# Altium schematic sheet FPGA.SCHDOC: FPGA Connections
size A2; Address1: Level 3, 12a Rodborough Rd; Address2: Frenchs Forest 2086; Address3: NSW; Address4: AUSTRALIA; SheetNumber: 4; SheetTotal: 23; PageSetup: Record=PageOptions|CenterHorizontal=True|CenterVertical=True|PrintScale=0.71|XCorrection=1.00|YCorrection=1.00|PrintKind=0|BorderSize=5000000|LeftOffset=0|BottomOffset=0|Orientation=2|PaperLength=4199|PaperWidth=2969|Scale=100|PaperSource=7|PrintQuality=600|MediaType=1|DitherType=10|PaperKind=A3 (297 x 420 mm)|PrintScaleMode=1
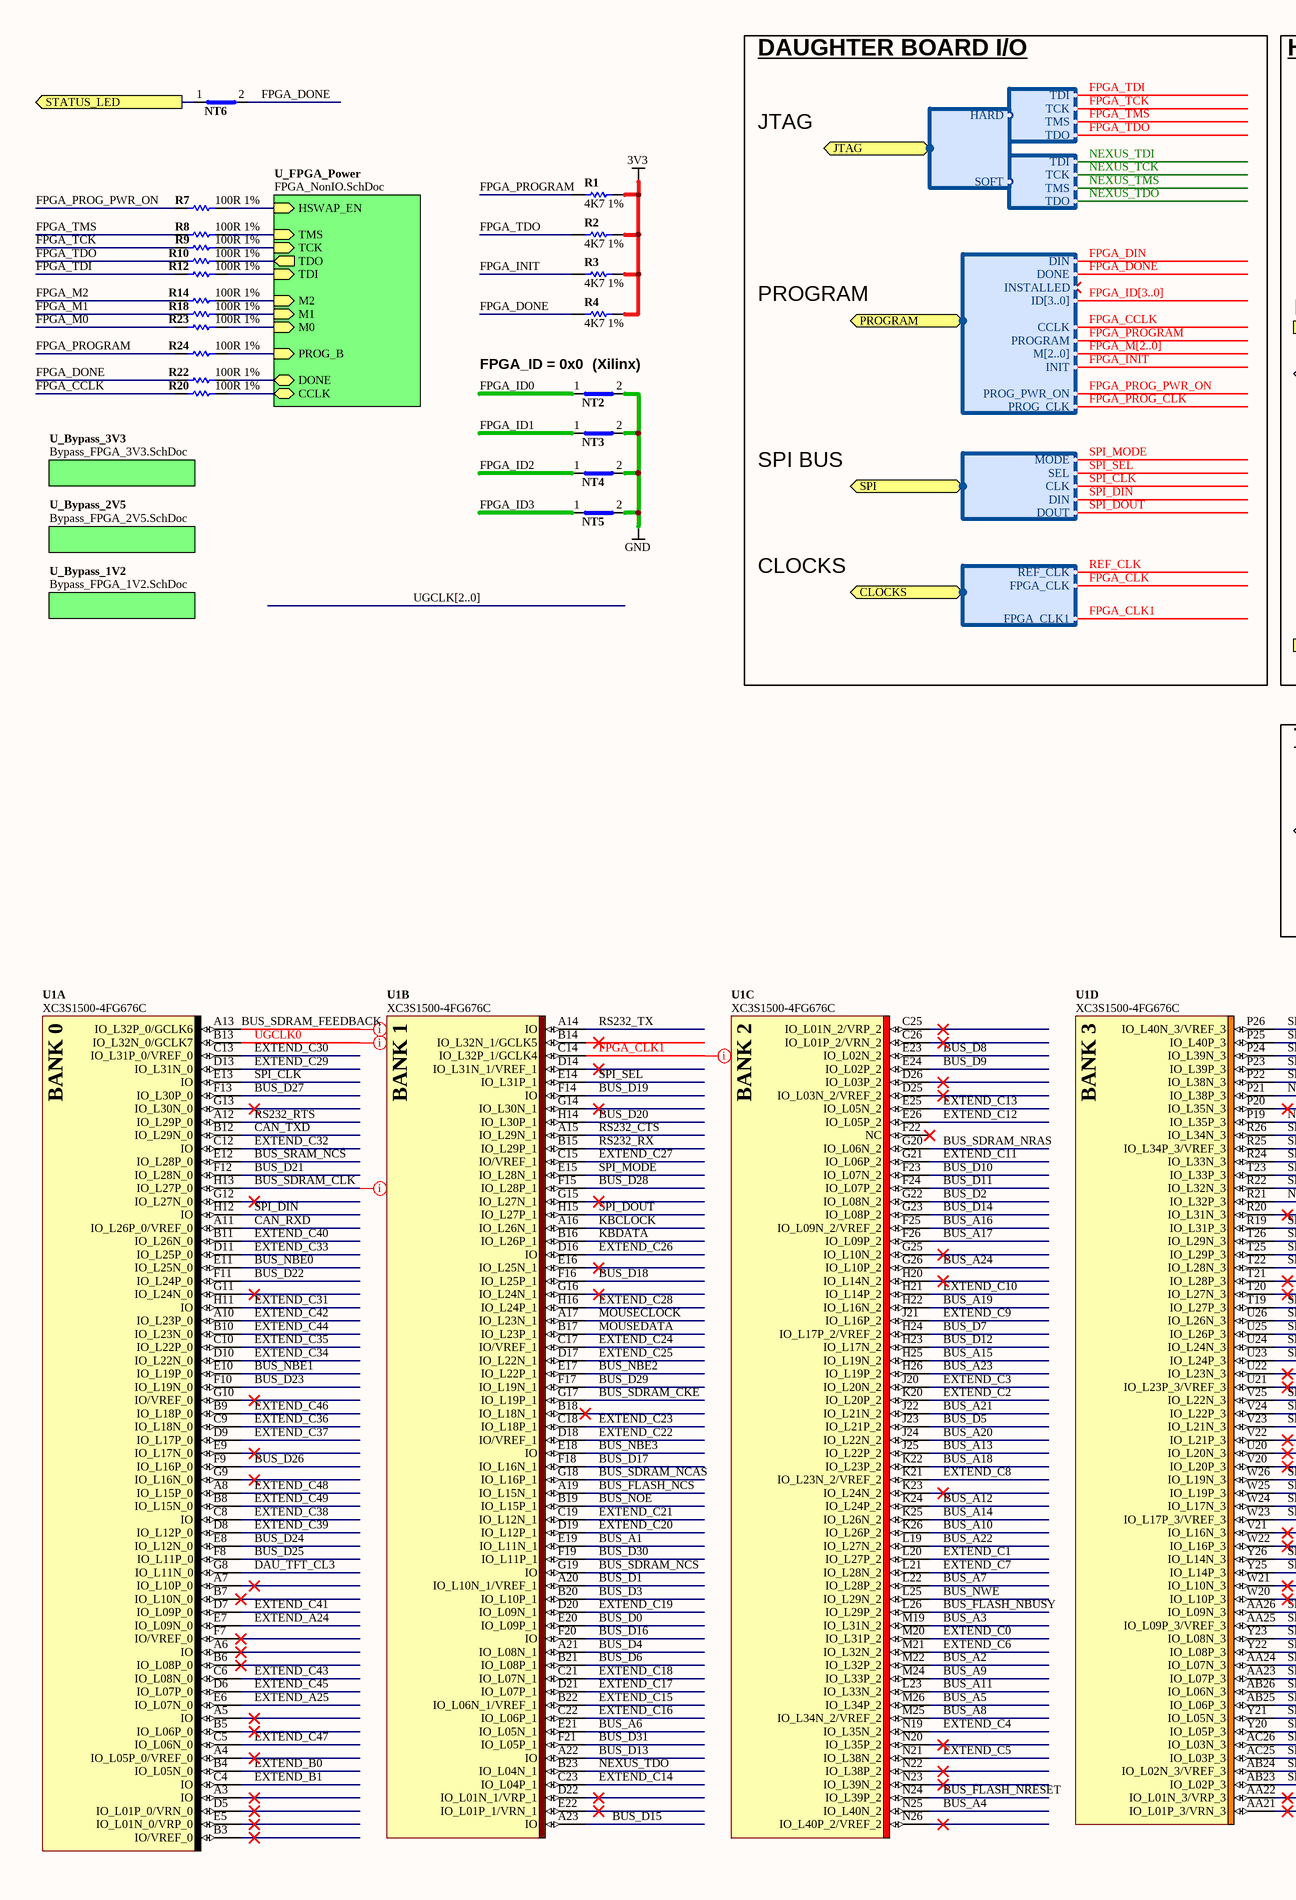
[diagram p0: FPGA.SCHDOC, left]
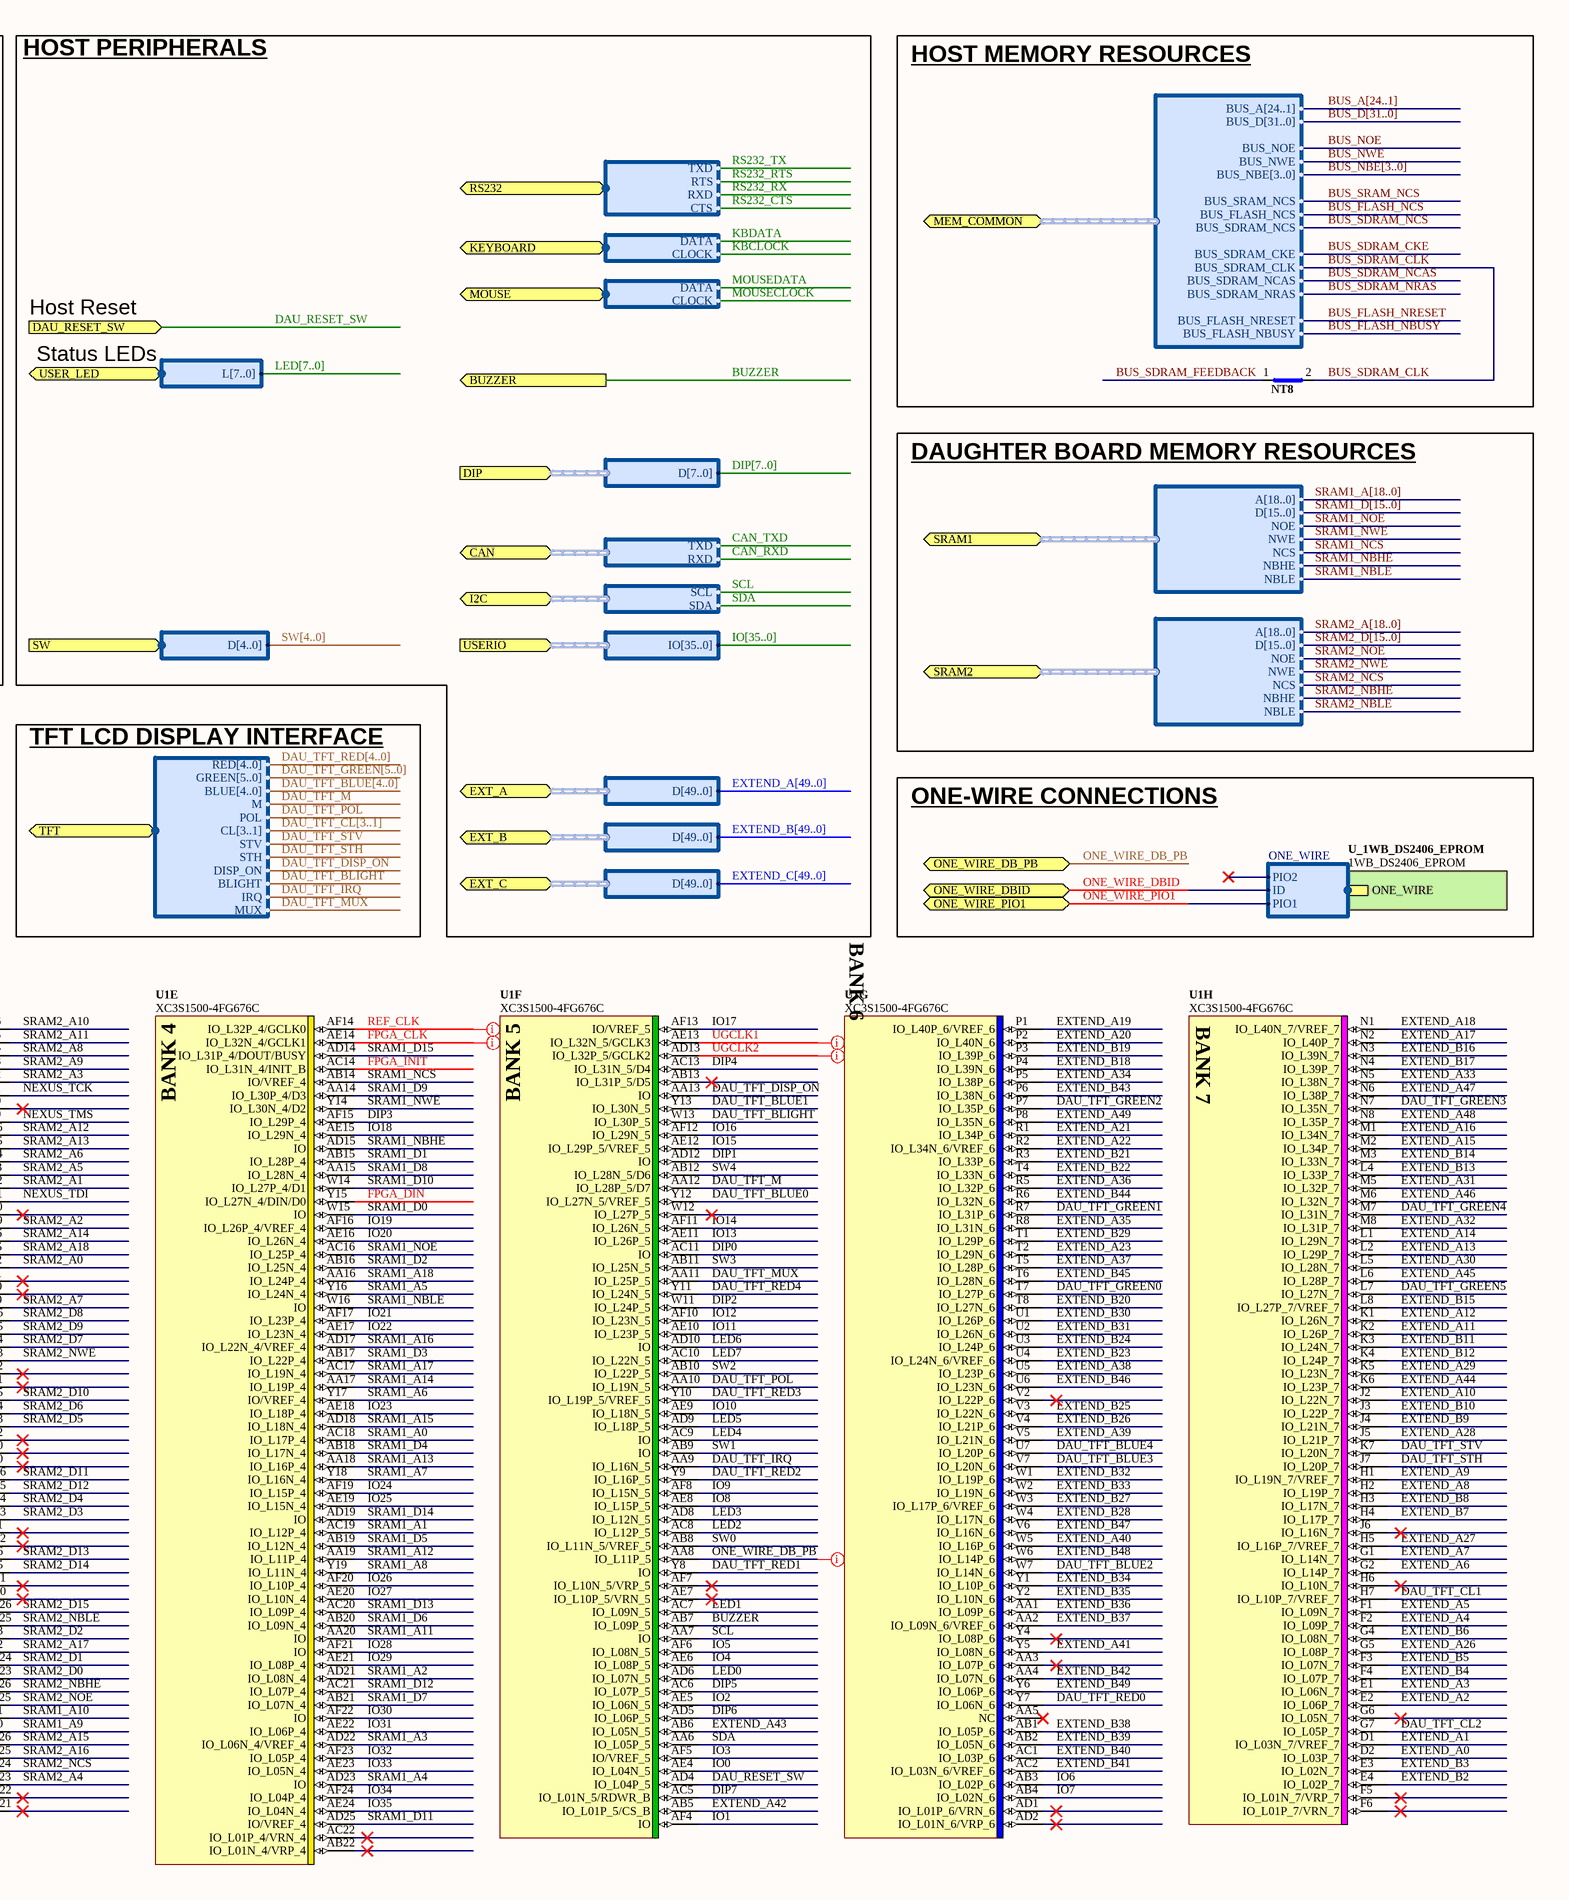
[diagram p1: FPGA.SCHDOC, right]

## Parts
NT2  Net Tie SMT2  [NETTIE-SMT2-8X8]  (value not drawn)  (net tie, no BOM)
NT3  Net Tie SMT2  [NETTIE-SMT2-8X8]  (value not drawn)  (net tie, no BOM)
NT4  Net Tie SMT2  [NETTIE-SMT2-8X8]  (value not drawn)  (net tie, no BOM)
NT5  Net Tie SMT2  [NETTIE-SMT2-8X8]  (value not drawn)  (net tie, no BOM)
NT6  Net Tie SMT2  [NETTIE-SMT2-8X8]  (value not drawn)  (net tie, no BOM)
NT8  Net Tie SMT2  [NETTIE-SMT2-8X8]  (value not drawn)  (net tie, no BOM)
R1  4K7 1%  [RESC1005-STAR]
R2  4K7 1%  [RESC1005-STAR]
R3  4K7 1%  [RESC1005-STAR]
R4  4K7 1%  [RESC1005-STAR]
R7  100R 1%  [RESC1005-STAR]
R8  100R 1%  [RESC1005-STAR]
R9  100R 1%  [RESC1005-STAR]
R10  100R 1%  [RESC1005-STAR]
R12  100R 1%  [RESC1005-STAR]
R14  100R 1%  [RESC1005-STAR]
R18  100R 1%  [RESC1005-STAR]
R20  100R 1%  [RESC1005-STAR]
R22  100R 1%  [RESC1005-STAR]
R23  100R 1%  [RESC1005-STAR]
R24  100R 1%  [RESC1005-STAR]
U1  XC3S1500-4FG676C  [BGA100P26X26-676]  (parts A,B,C,D,E,F,G,H of 12)

## Blocks framed on the sheet
HOST MEMORY RESOURCES: NT8

## Sub-sheets
U_1WB_DS2406_EPROM = 1WB_DS2406_EPROM: ONE_WIRE (harness ONE_WIRE)
U_Bypass_1V2 = Bypass_FPGA_1V2.SchDoc: no entries
U_Bypass_2V5 = Bypass_FPGA_2V5.SchDoc: no entries
U_Bypass_3V3 = Bypass_FPGA_3V3.SchDoc: no entries
U_FPGA_Power = FPGA_NonIO.SchDoc: TMS (in), DONE (bidir), M1 (in), CCLK (bidir), M0 (in), M2 (in), TCK (in), HSWAP_EN (in), TDI (in), PROG_B (in), TDO (out)

## Ports
BUZZER (out), CAN (harness CAN_INT), CLOCKS (harness DAU_CLK), DAU_RESET_SW (in), DIP (harness SW8), EXT_A (harness PBIO), EXT_B (harness PBIO), EXT_C (harness PBIO), I2C (harness I2C), JTAG (harness HARDSOFT_JTAG), KEYBOARD (harness PS2), MEM_COMMON (harness HOSTMEMORY), MOUSE (harness PS2), ONE_WIRE_DB_PB (bidir), ONE_WIRE_DBID (bidir), ONE_WIRE_PIO1 (bidir), PROGRAM (harness DAU_CTRL), RS232 (harness RS232_INT), SPI (harness DAU_SPI), SRAM1 (harness SRAM-256Kx16), SRAM2 (harness SRAM-256Kx16), STATUS_LED (out), SW (harness SW5), TFT (harness DAU_TFT), USER_LED (harness LED8), USERIO (harness IO36)

## Harnesses
ONE_WIRE: ID, PIO1, PIO2
SRAM-256Kx16: A[18..0], D[15..0], NCS, NWE, NOE, NBHE, NBLE
HOSTMEMORY: BUS_A[24..1], BUS_D[31..0], BUS_NOE, BUS_NWE, BUS_NBE[3..0], BUS_SRAM_NCS, BUS_FLASH_NCS, BUS_SDRAM_NCS, BUS_SDRAM_CKE, BUS_SDRAM_CLK, BUS_SDRAM_NCAS, BUS_SDRAM_NRAS, BUS_FLASH_NRESET, BUS_FLASH_NBUSY
DAU_CLK: REF_CLK, FPGA_CLK, FPGA_CLK1
DAU_SPI: MODE, SEL, CLK, DIN, DOUT
DAU_CTRL: DIN, DONE, INSTALLED, ID[3..0], CCLK, PROGRAM, M[2..0], INIT, PROG_PWR_ON, PROG_CLK
JTAG: TMS, TDO, TDI, TCK
HARDSOFT_JTAG: HARD, SOFT
LED8: L[7..0]
SW5: D[4..0]
DAU_TFT: RED[4..0], GREEN[5..0], BLUE[4..0], M, POL, CL[3..1], STV, STH, DISP_ON, BLIGHT, IRQ, MUX
PS2: DATA, CLOCK
RS232_INT: RXD, TXD, RTS, CTS
IO36: IO[35..0]
SW8: D[7..0]
CAN_INT: TXD, RXD
I2C: SCL, SDA
PBIO: D[49..0]

## Nets
3V3: R1.2 R2.2 R3.2 R4.2
GND: NT2.2(Net2) NT3.2(Net2) NT4.2(Net2) NT5.2(Net2)
BUS_A1: U1.E19(IO_L11N_1)
BUS_A2: U1.M22(IO_L32P_2)
BUS_A3: U1.M19(IO_L31N_2)
BUS_A4: U1.N25(IO_L40N_2)
BUS_A5: U1.M26(IO_L34P_2)
BUS_A6: U1.E21(IO_L05N_1)
BUS_A7: U1.L22(IO_L28P_2)
BUS_A8: U1.M25(IO_L34N_2/VREF_2)
BUS_A9: U1.M24(IO_L33P_2)
BUS_A10: U1.K26(IO_L26P_2)
BUS_A11: U1.L23(IO_L33N_2)
BUS_A12: U1.K24(IO_L24P_2)
BUS_A13: U1.J25(IO_L22P_2)
BUS_A14: U1.K25(IO_L26N_2)
BUS_A15: U1.H25(IO_L19N_2)
BUS_A16: U1.F25(IO_L09N_2/VREF_2)
BUS_A17: U1.F26(IO_L09P_2)
BUS_A18: U1.K22(IO_L23P_2)
BUS_A19: U1.H22(IO_L16N_2)
BUS_A20: U1.J24(IO_L22N_2)
BUS_A21: U1.J22(IO_L21N_2)
BUS_A22: U1.L19(IO_L27N_2)
BUS_A23: U1.H26(IO_L19P_2)
BUS_A24: U1.G26(IO_L10P_2)
BUS_D0: U1.E20(IO_L09P_1)
BUS_D1: U1.A20(IO_L10N_1/VREF_1)
BUS_D2: U1.G22(IO_L08N_2)
BUS_D3: U1.B20(IO_L10P_1)
BUS_D4: U1.A21(IO_L08N_1)
BUS_D5: U1.J23(IO_L21P_2)
BUS_D6: U1.B21(IO_L08P_1)
BUS_D7: U1.H24(IO_L17P_2/VREF_2)
BUS_D8: U1.E23(IO_L02N_2)
BUS_D9: U1.E24(IO_L02P_2)
BUS_D10: U1.F23(IO_L07N_2)
BUS_D11: U1.F24(IO_L07P_2)
BUS_D12: U1.H23(IO_L17N_2)
BUS_D13: U1.A22(IO)
BUS_D14: U1.G23(IO_L08P_2)
BUS_D15: U1.A23(IO)
BUS_D16: U1.F20(IO)
BUS_D17: U1.F18(IO_L16N_1)
BUS_D18: U1.F16(IO_L25P_1)
BUS_D19: U1.F14(IO)
BUS_D20: U1.H14(IO_L30P_1)
BUS_D21: U1.F12(IO_L28N_0)
BUS_D22: U1.F11(IO_L24P_0)
BUS_D23: U1.F10(IO_L19N_0)
BUS_D24: U1.E8(IO_L12N_0)
BUS_D25: U1.F8(IO_L11P_0)
BUS_D26: U1.F9(IO_L16P_0)
BUS_D27: U1.F13(IO_L30P_0)
BUS_D28: U1.F15(IO_L28P_1)
BUS_D29: U1.F17(IO_L19N_1)
BUS_D30: U1.F19(IO_L11P_1)
BUS_D31: U1.F21(IO_L05P_1)
BUS_FLASH_NBUSY: U1.L26(IO_L29P_2) ; port MEM_COMMON.BUS_FLASH_NBUSY
BUS_FLASH_NCS: U1.A19(IO_L15N_1) ; port MEM_COMMON.BUS_FLASH_NCS
BUS_FLASH_NRESET: U1.N24(IO_L39P_2) ; port MEM_COMMON.BUS_FLASH_NRESET
BUS_NBE0: U1.E11(IO_L25N_0)
BUS_NBE1: U1.E10(IO_L19P_0)
BUS_NBE2: U1.E17(IO_L22P_1)
BUS_NBE3: U1.E18(IO)
BUS_NOE: U1.B19(IO_L15P_1) ; port MEM_COMMON.BUS_NOE
BUS_NWE: U1.L25(IO_L29N_2) ; port MEM_COMMON.BUS_NWE
BUS_SDRAM_CKE: U1.G17(IO_L19P_1) ; port MEM_COMMON.BUS_SDRAM_CKE
BUS_SDRAM_CLK: NT8.2(Net2) U1.H13(IO_L27P_0) ; port MEM_COMMON.BUS_SDRAM_CLK
BUS_SDRAM_FEEDBACK: NT8.1(Net1) U1.A13(IO_L32P_0/GCLK6)
BUS_SDRAM_NCAS: U1.G18(IO_L16P_1) ; port MEM_COMMON.BUS_SDRAM_NCAS
BUS_SDRAM_NCS: U1.G19(IO) ; port MEM_COMMON.BUS_SDRAM_NCS
BUS_SDRAM_NRAS: U1.G20(IO_L06N_2) ; port MEM_COMMON.BUS_SDRAM_NRAS
BUS_SRAM_NCS: U1.E12(IO_L28P_0) ; port MEM_COMMON.BUS_SRAM_NCS
BUZZER: U1.AB7(IO_L09P_5) ; port BUZZER
CAN_RXD: U1.A11(IO_L26P_0/VREF_0) ; port CAN.RXD
CAN_TXD: U1.B12(IO_L29N_0) ; port CAN.TXD
DAU_RESET_SW: U1.AD4(IO_L04P_5) ; port DAU_RESET_SW
DAU_TFT_BLIGHT: U1.W13(IO_L30P_5) ; port TFT.BLIGHT
DAU_TFT_BLUE0: U1.Y12(IO_L27N_5/VREF_5)
DAU_TFT_BLUE1: U1.Y13(IO_L30N_5)
DAU_TFT_BLUE2: U1.W7(IO_L14N_6)
DAU_TFT_BLUE3: U1.V7(IO_L20N_6)
DAU_TFT_BLUE4: U1.U7(IO_L20P_6)
DAU_TFT_CL1: U1.H7(IO_L10P_7/VREF_7)
DAU_TFT_CL2: U1.G7(IO_L05P_7)
DAU_TFT_CL3: U1.G8(IO_L11N_0)
DAU_TFT_DISP_ON: U1.AA13(IO) ; port TFT.DISP_ON
DAU_TFT_GREEN0: U1.T7(IO_L27P_6)
DAU_TFT_GREEN1: U1.R7(IO_L31P_6)
DAU_TFT_GREEN2: U1.P7(IO_L35P_6)
DAU_TFT_GREEN3: U1.N7(IO_L35N_7)
DAU_TFT_GREEN4: U1.M7(IO_L31N_7)
DAU_TFT_GREEN5: U1.L7(IO_L27N_7)
DAU_TFT_IRQ: U1.AA9(IO_L16N_5) ; port TFT.IRQ
DAU_TFT_M: U1.AA12(IO_L28P_5/D7) ; port TFT.M
DAU_TFT_MUX: U1.AA11(IO_L25P_5) ; port TFT.MUX
DAU_TFT_POL: U1.AA10(IO_L19N_5) ; port TFT.POL
DAU_TFT_RED0: U1.Y7(IO_L06N_6)
DAU_TFT_RED1: U1.Y8(IO)
DAU_TFT_RED2: U1.Y9(IO_L16P_5)
DAU_TFT_RED3: U1.Y10(IO_L19P_5/VREF_5)
DAU_TFT_RED4: U1.Y11(IO_L24N_5)
DAU_TFT_STH: U1.J7(IO_L20P_7) ; port TFT.STH
DAU_TFT_STV: U1.K7(IO_L20N_7) ; port TFT.STV
DIP0: U1.AC11(IO)
DIP1: U1.AD12(IO)
DIP2: U1.W11(IO_L24P_5)
DIP3: U1.AF15(IO_L29P_4)
DIP4: U1.AC13(IO_L31N_5/D4)
DIP5: U1.AC6(IO_L07P_5)
DIP6: U1.AD5(IO_L06P_5)
DIP7: U1.AC5(IO_L01N_5/RDWR_B)
EXTEND_A0: U1.D2(IO_L03P_7)
EXTEND_A1: U1.D1(IO_L03N_7/VREF_7)
EXTEND_A2: U1.E2(IO_L06P_7)
EXTEND_A3: U1.E1(IO_L06N_7)
EXTEND_A4: U1.F2(IO_L09P_7)
EXTEND_A5: U1.F1(IO_L09N_7)
EXTEND_A6: U1.G2(IO_L14P_7)
EXTEND_A7: U1.G1(IO_L14N_7)
EXTEND_A8: U1.H2(IO_L19P_7)
EXTEND_A9: U1.H1(IO_L19N_7/VREF_7)
EXTEND_A10: U1.J2(IO_L22N_7)
EXTEND_A11: U1.K2(IO_L26P_7)
EXTEND_A12: U1.K1(IO_L26N_7)
EXTEND_A13: U1.L2(IO_L29P_7)
EXTEND_A14: U1.L1(IO_L29N_7)
EXTEND_A15: U1.M2(IO_L34P_7)
EXTEND_A16: U1.M1(IO_L34N_7)
EXTEND_A17: U1.N2(IO_L40P_7)
EXTEND_A18: U1.N1(IO_L40N_7/VREF_7)
EXTEND_A19: U1.P1(IO_L40P_6/VREF_6)
EXTEND_A20: U1.P2(IO_L40N_6)
EXTEND_A21: U1.R1(IO_L34P_6)
EXTEND_A22: U1.R2(IO_L34N_6/VREF_6)
EXTEND_A23: U1.T2(IO_L29N_6)
EXTEND_A24: U1.E7(IO_L09N_0)
EXTEND_A25: U1.E6(IO_L07N_0)
EXTEND_A26: U1.G5(IO_L08P_7)
EXTEND_A27: U1.H5(IO_L16P_7/VREF_7)
EXTEND_A28: U1.J5(IO_L21P_7)
EXTEND_A29: U1.K5(IO_L23N_7)
EXTEND_A30: U1.L5(IO_L28N_7)
EXTEND_A31: U1.M5(IO_L32P_7)
EXTEND_A32: U1.M8(IO_L31P_7)
EXTEND_A33: U1.N5(IO_L38N_7)
EXTEND_A34: U1.P5(IO_L38P_6)
EXTEND_A35: U1.R8(IO_L31N_6)
EXTEND_A36: U1.R5(IO_L32P_6)
EXTEND_A37: U1.T5(IO_L28P_6)
EXTEND_A38: U1.U5(IO_L23P_6)
EXTEND_A39: U1.V5(IO_L21N_6)
EXTEND_A40: U1.W5(IO_L16P_6)
EXTEND_A41: U1.Y5(IO_L08N_6)
EXTEND_A42: U1.AB5(IO_L01P_5/CS_B)
EXTEND_A43: U1.AB6(IO_L05N_5)
EXTEND_A44: U1.K6(IO_L23P_7)
EXTEND_A45: U1.L6(IO_L28P_7)
EXTEND_A46: U1.M6(IO_L32N_7)
EXTEND_A47: U1.N6(IO_L38P_7)
EXTEND_A48: U1.N8(IO_L35P_7)
EXTEND_A49: U1.P8(IO_L35N_6)
EXTEND_B0: U1.B4(IO_L05N_0)
EXTEND_B1: U1.C4(IO)
EXTEND_B2: U1.E4(IO_L02P_7)
EXTEND_B3: U1.E3(IO_L02N_7)
EXTEND_B4: U1.F4(IO_L07P_7)
EXTEND_B5: U1.F3(IO_L07N_7)
EXTEND_B6: U1.G4(IO_L08N_7)
EXTEND_B7: U1.H4(IO_L17P_7)
EXTEND_B8: U1.H3(IO_L17N_7)
EXTEND_B9: U1.J4(IO_L21N_7)
EXTEND_B10: U1.J3(IO_L22P_7)
EXTEND_B11: U1.K3(IO_L24N_7)
EXTEND_B12: U1.K4(IO_L24P_7)
EXTEND_B13: U1.L4(IO_L33P_7)
EXTEND_B14: U1.M3(IO_L33N_7)
EXTEND_B15: U1.L8(IO_L27P_7/VREF_7)
EXTEND_B16: U1.N3(IO_L39N_7)
EXTEND_B17: U1.N4(IO_L39P_7)
EXTEND_B18: U1.P4(IO_L39N_6)
EXTEND_B19: U1.P3(IO_L39P_6)
EXTEND_B20: U1.T8(IO_L27N_6)
EXTEND_B21: U1.R3(IO_L33P_6)
EXTEND_B22: U1.T4(IO_L33N_6)
EXTEND_B23: U1.U4(IO_L24N_6/VREF_6)
EXTEND_B24: U1.U3(IO_L24P_6)
EXTEND_B25: U1.V3(IO_L22N_6)
EXTEND_B26: U1.V4(IO_L21P_6)
EXTEND_B27: U1.W3(IO_L17P_6/VREF_6)
EXTEND_B28: U1.W4(IO_L17N_6)
EXTEND_B29: U1.T1(IO_L29P_6)
EXTEND_B30: U1.U1(IO_L26P_6)
EXTEND_B31: U1.U2(IO_L26N_6)
EXTEND_B32: U1.W1(IO_L19P_6)
EXTEND_B33: U1.W2(IO_L19N_6)
EXTEND_B34: U1.Y1(IO_L10P_6)
EXTEND_B35: U1.Y2(IO_L10N_6)
EXTEND_B36: U1.AA1(IO_L09P_6)
EXTEND_B37: U1.AA2(IO_L09N_6/VREF_6)
EXTEND_B38: U1.AB1(IO_L05P_6)
EXTEND_B39: U1.AB2(IO_L05N_6)
EXTEND_B40: U1.AC1(IO_L03P_6)
EXTEND_B41: U1.AC2(IO_L03N_6/VREF_6)
EXTEND_B42: U1.AA4(IO_L07N_6)
EXTEND_B43: U1.P6(IO_L38N_6)
EXTEND_B44: U1.R6(IO_L32N_6)
EXTEND_B45: U1.T6(IO_L28N_6)
EXTEND_B46: U1.U6(IO_L23N_6)
EXTEND_B47: U1.V6(IO_L16N_6)
EXTEND_B48: U1.W6(IO_L14P_6)
EXTEND_B49: U1.Y6(IO_L06P_6)
EXTEND_C0: U1.M20(IO_L31P_2)
EXTEND_C1: U1.L20(IO_L27P_2)
EXTEND_C2: U1.K20(IO_L20P_2)
EXTEND_C3: U1.J20(IO_L20N_2)
EXTEND_C4: U1.N19(IO_L35N_2)
EXTEND_C5: U1.N21(IO_L38N_2)
EXTEND_C6: U1.M21(IO_L32N_2)
EXTEND_C7: U1.L21(IO_L28N_2)
EXTEND_C8: U1.K21(IO_L23N_2/VREF_2)
EXTEND_C9: U1.J21(IO_L16P_2)
EXTEND_C10: U1.H21(IO_L14P_2)
EXTEND_C11: U1.G21(IO_L06P_2)
EXTEND_C12: U1.E26(IO_L05P_2)
EXTEND_C13: U1.E25(IO_L05N_2)
EXTEND_C14: U1.C23(IO_L04P_1)
EXTEND_C15: U1.B22(IO_L06N_1/VREF_1)
EXTEND_C16: U1.C22(IO_L06P_1)
EXTEND_C17: U1.D21(IO_L07P_1)
EXTEND_C18: U1.C21(IO_L07N_1)
EXTEND_C19: U1.D20(IO_L09N_1)
EXTEND_C20: U1.D19(IO_L12P_1)
EXTEND_C21: U1.C19(IO_L12N_1)
EXTEND_C22: U1.D18(IO/VREF_1)
EXTEND_C23: U1.C18(IO_L18P_1)
EXTEND_C24: U1.C17(IO/VREF_1)
EXTEND_C25: U1.D17(IO_L22N_1)
EXTEND_C26: U1.D16(IO)
EXTEND_C27: U1.C15(IO/VREF_1)
EXTEND_C28: U1.H16(IO_L24P_1)
EXTEND_C29: U1.D13(IO_L31N_0)
EXTEND_C30: U1.C13(IO_L31P_0/VREF_0)
EXTEND_C31: U1.H11(IO)
EXTEND_C32: U1.C12(IO)
EXTEND_C33: U1.D11(IO_L25P_0)
EXTEND_C34: U1.D10(IO_L22N_0)
EXTEND_C35: U1.C10(IO_L22P_0)
EXTEND_C36: U1.C9(IO_L18N_0)
EXTEND_C37: U1.D9(IO_L17P_0)
EXTEND_C38: U1.C8(IO)
EXTEND_C39: U1.D8(IO_L12P_0)
EXTEND_C40: U1.B11(IO_L26N_0)
EXTEND_C41: U1.D7(IO_L09P_0)
EXTEND_C42: U1.A10(IO_L23P_0)
EXTEND_C43: U1.C6(IO_L08N_0)
EXTEND_C44: U1.B10(IO_L23N_0)
EXTEND_C45: U1.D6(IO_L07P_0)
EXTEND_C46: U1.B9(IO_L18P_0)
EXTEND_C47: U1.C5(IO_L06N_0)
EXTEND_C48: U1.A8(IO_L15P_0)
EXTEND_C49: U1.B8(IO_L15N_0)
FPGA_CCLK: R20.1 ; port PROGRAM.CCLK
FPGA_CLK: U1.AE14(IO_L32N_4/GCLK1) ; port CLOCKS.FPGA_CLK
FPGA_CLK1: U1.C14(IO_L32P_1/GCLK4) ; port CLOCKS.FPGA_CLK1
FPGA_DIN: U1.Y15(IO_L27N_4/DIN/D0) ; port PROGRAM.DIN
FPGA_DONE: NT6.2(Net2) R4.1 R22.1 ; port PROGRAM.DONE
FPGA_ID0: NT2.1(Net1)
FPGA_ID1: NT3.1(Net1)
FPGA_ID2: NT4.1(Net1)
FPGA_ID3: NT5.1(Net1)
FPGA_INIT: R3.1 U1.AC14(IO_L31N_4/INIT_B) ; port PROGRAM.INIT
FPGA_M0: R23.1
FPGA_M1: R18.1
FPGA_M2: R14.1
FPGA_PROG_CLK: port PROGRAM.PROG_CLK
FPGA_PROG_PWR_ON: R7.1 ; port PROGRAM.PROG_PWR_ON
FPGA_PROGRAM: R1.1 R24.1 ; port PROGRAM.PROGRAM
FPGA_TCK: R9.1 ; harness JTAG.TCK
FPGA_TDI: R12.1 ; harness JTAG.TDI
FPGA_TDO: R2.1 R10.1 ; harness JTAG.TDO
FPGA_TMS: R8.1 ; harness JTAG.TMS
IO0: U1.AE4(IO_L04N_5)
IO1: U1.AF4(IO)
IO2: U1.AE5(IO_L06N_5)
IO3: U1.AF5(IO/VREF_5)
IO4: U1.AE6(IO_L08P_5)
IO5: U1.AF6(IO_L08N_5)
IO6: U1.AB3(IO_L02P_6)
IO7: U1.AB4(IO_L02N_6)
IO8: U1.AE8(IO_L15P_5)
IO9: U1.AF8(IO_L15N_5)
IO10: U1.AE9(IO_L18N_5)
IO11: U1.AE10(IO_L23P_5)
IO12: U1.AF10(IO_L23N_5)
IO13: U1.AE11(IO_L26P_5)
IO14: U1.AF11(IO_L26N_5)
IO15: U1.AE12(IO_L29P_5/VREF_5)
IO16: U1.AF12(IO_L29N_5)
IO17: U1.AF13(IO/VREF_5)
IO18: U1.AE15(IO_L29N_4)
IO19: U1.AF16(IO_L26P_4/VREF_4)
IO20: U1.AE16(IO_L26N_4)
IO21: U1.AF17(IO_L23P_4)
IO22: U1.AE17(IO_L23N_4)
IO23: U1.AE18(IO_L18P_4)
IO24: U1.AF19(IO_L15P_4)
IO25: U1.AE19(IO_L15N_4)
IO26: U1.AF20(IO_L10P_4)
IO27: U1.AE20(IO_L10N_4)
IO28: U1.AF21(IO)
IO29: U1.AE21(IO_L08P_4)
IO30: U1.AF22(IO)
IO31: U1.AE22(IO_L06P_4)
IO32: U1.AF23(IO_L05P_4)
IO33: U1.AE23(IO_L05N_4)
IO34: U1.AF24(IO_L04P_4)
IO35: U1.AE24(IO_L04N_4)
KBCLOCK: U1.A16(IO_L26N_1) ; port KEYBOARD.CLOCK
KBDATA: U1.B16(IO_L26P_1) ; port KEYBOARD.DATA
LED0: U1.AD6(IO_L07N_5)
LED1: U1.AC7(IO_L09N_5)
LED2: U1.AC8(IO_L12P_5)
LED3: U1.AD8(IO_L12N_5)
LED4: U1.AC9(IO)
LED5: U1.AD9(IO_L18P_5)
LED6: U1.AD10(IO)
LED7: U1.AC10(IO_L22N_5)
MOUSECLOCK: U1.A17(IO_L23N_1) ; port MOUSE.CLOCK
MOUSEDATA: U1.B17(IO_L23P_1) ; port MOUSE.DATA
NEXUS_TCK: U1.P21(IO_L38P_3) ; harness JTAG.TCK
NEXUS_TDI: U1.R21(IO_L32P_3) ; harness JTAG.TDI
NEXUS_TDO: U1.B23(IO_L04N_1) ; harness JTAG.TDO
NEXUS_TMS: U1.P19(IO_L35P_3) ; harness JTAG.TMS
ONE_WIRE_DB_PB: U1.AA8(IO_L11P_5) ; port ONE_WIRE_DB_PB
ONE_WIRE_DBID: port ONE_WIRE_DBID, sheet U_1WB_DS2406_EPROM/ONE_WIRE.ID
ONE_WIRE_PIO1: port ONE_WIRE_PIO1, sheet U_1WB_DS2406_EPROM/ONE_WIRE.PIO1
REF_CLK: U1.AF14(IO_L32P_4/GCLK0) ; port CLOCKS.REF_CLK
RS232_CTS: U1.A15(IO_L29N_1) ; port RS232.CTS
RS232_RTS: U1.A12(IO_L29P_0) ; port RS232.RTS
RS232_RX: U1.B15(IO_L29P_1) ; port RS232.RXD
RS232_TX: U1.A14(IO) ; port RS232.TXD
SCL: U1.AA7(IO) ; port I2C.SCL
SDA: U1.AA6(IO_L05P_5) ; port I2C.SDA
SPI_CLK: U1.E13(IO) ; port SPI.CLK
SPI_DIN: U1.H12(IO) ; port SPI.DIN
SPI_DOUT: U1.H15(IO_L27P_1) ; port SPI.DOUT
SPI_MODE: U1.E15(IO_L28N_1) ; port SPI.MODE
SPI_SEL: U1.E14(IO_L31P_1) ; port SPI.SEL
SRAM1_A0: U1.AC18(IO_L17P_4)
SRAM1_A1: U1.AC19(IO_L12P_4)
SRAM1_A2: U1.AD21(IO_L08N_4)
SRAM1_A3: U1.AD22(IO_L06N_4/VREF_4)
SRAM1_A4: U1.AD23(IO)
SRAM1_A5: U1.Y16(IO_L24N_4)
SRAM1_A6: U1.Y17(IO/VREF_4)
SRAM1_A7: U1.Y18(IO_L16N_4)
SRAM1_A8: U1.Y19(IO_L11N_4)
SRAM1_A9: U1.Y20(IO_L05P_3)
SRAM1_A10: U1.Y21(IO_L05N_3)
SRAM1_A11: U1.AA20(IO)
SRAM1_A12: U1.AA19(IO_L11P_4)
SRAM1_A13: U1.AA18(IO_L16P_4)
SRAM1_A14: U1.AA17(IO_L19P_4)
SRAM1_A15: U1.AD18(IO_L18N_4)
SRAM1_A16: U1.AD17(IO_L22N_4/VREF_4)
SRAM1_A17: U1.AC17(IO_L19N_4)
SRAM1_A18: U1.AA16(IO_L24P_4)
SRAM1_D0: U1.W15(IO)
SRAM1_D1: U1.AB15(IO_L28P_4)
SRAM1_D2: U1.AB16(IO_L25N_4)
SRAM1_D3: U1.AB17(IO_L22P_4)
SRAM1_D4: U1.AB18(IO_L17N_4)
SRAM1_D5: U1.AB19(IO_L12N_4)
SRAM1_D6: U1.AB20(IO_L09N_4)
SRAM1_D7: U1.AB21(IO_L07N_4)
SRAM1_D8: U1.AA15(IO_L28N_4)
SRAM1_D9: U1.AA14(IO_L30P_4/D3)
SRAM1_D10: U1.W14(IO_L27P_4/D1)
SRAM1_D11: U1.AD25(IO/VREF_4)
SRAM1_D12: U1.AC21(IO_L07P_4)
SRAM1_D13: U1.AC20(IO_L09P_4)
SRAM1_D14: U1.AD19(IO)
SRAM1_D15: U1.AD14(IO_L31P_4/DOUT/BUSY)
SRAM1_NBHE: U1.AD15(IO) ; port SRAM1.NBHE
SRAM1_NBLE: U1.W16(IO) ; port SRAM1.NBLE
SRAM1_NCS: U1.AB14(IO/VREF_4) ; port SRAM1.NCS
SRAM1_NOE: U1.AC16(IO_L25P_4) ; port SRAM1.NOE
SRAM1_NWE: U1.Y14(IO_L30N_4/D2) ; port SRAM1.NWE
SRAM2_A0: U1.T22(IO_L28N_3)
SRAM2_A1: U1.R22(IO_L32N_3)
SRAM2_A2: U1.R19(IO_L31P_3)
SRAM2_A3: U1.P22(IO_L38N_3)
SRAM2_A4: U1.AB23(IO_L02P_3)
SRAM2_A5: U1.T23(IO_L33P_3)
SRAM2_A6: U1.R24(IO_L33N_3)
SRAM2_A7: U1.T19(IO_L27P_3)
SRAM2_A8: U1.P24(IO_L39N_3)
SRAM2_A9: U1.P23(IO_L39P_3)
SRAM2_A10: U1.P26(IO_L40N_3/VREF_3)
SRAM2_A11: U1.P25(IO_L40P_3)
SRAM2_A12: U1.R26(IO_L34N_3)
SRAM2_A13: U1.R25(IO_L34P_3/VREF_3)
SRAM2_A14: U1.T26(IO_L29N_3)
SRAM2_A15: U1.AC26(IO_L03N_3)
SRAM2_A16: U1.AC25(IO_L03P_3)
SRAM2_A17: U1.Y22(IO_L08P_3)
SRAM2_A18: U1.T25(IO_L29P_3)
SRAM2_D0: U1.AA23(IO_L07P_3)
SRAM2_D1: U1.AA24(IO_L07N_3)
SRAM2_D2: U1.Y23(IO_L08N_3)
SRAM2_D3: U1.W23(IO_L17P_3/VREF_3)
SRAM2_D4: U1.W24(IO_L17N_3)
SRAM2_D5: U1.V23(IO_L21N_3)
SRAM2_D6: U1.V24(IO_L22P_3)
SRAM2_D7: U1.U24(IO_L24N_3)
SRAM2_D8: U1.U26(IO_L26N_3)
SRAM2_D9: U1.U25(IO_L26P_3)
SRAM2_D10: U1.V25(IO_L22N_3)
SRAM2_D11: U1.W26(IO_L19N_3)
SRAM2_D12: U1.W25(IO_L19P_3)
SRAM2_D13: U1.Y26(IO_L14N_3)
SRAM2_D14: U1.Y25(IO_L14P_3)
SRAM2_D15: U1.AA26(IO_L09N_3)
SRAM2_NBHE: U1.AB26(IO_L06N_3) ; port SRAM2.NBHE
SRAM2_NBLE: U1.AA25(IO_L09P_3/VREF_3) ; port SRAM2.NBLE
SRAM2_NCS: U1.AB24(IO_L02N_3/VREF_3) ; port SRAM2.NCS
SRAM2_NOE: U1.AB25(IO_L06P_3) ; port SRAM2.NOE
SRAM2_NWE: U1.U23(IO_L24P_3) ; port SRAM2.NWE
STATUS_LED: NT6.1(Net1) ; port STATUS_LED
SW0: U1.AB8(IO_L11N_5/VREF_5)
SW1: U1.AB9(IO)
SW2: U1.AB10(IO_L22P_5)
SW3: U1.AB11(IO_L25N_5)
SW4: U1.AB12(IO_L28N_5/D6)
UGCLK0: U1.B13(IO_L32N_0/GCLK7)
UGCLK1: U1.AE13(IO_L32N_5/GCLK3)
UGCLK2: U1.AD13(IO_L32P_5/GCLK2)
NetR7_2: R7.2 ; sheet U_FPGA_Power/HSWAP_EN
NetR8_2: R8.2 ; sheet U_FPGA_Power/TMS
NetR9_2: R9.2 ; sheet U_FPGA_Power/TCK
NetR10_2: R10.2 ; sheet U_FPGA_Power/TDO
NetR12_2: R12.2 ; sheet U_FPGA_Power/TDI
NetR14_2: R14.2 ; sheet U_FPGA_Power/M2
NetR18_2: R18.2 ; sheet U_FPGA_Power/M1
NetR20_2: R20.2 ; sheet U_FPGA_Power/CCLK
NetR22_2: R22.2 ; sheet U_FPGA_Power/DONE
NetR23_2: R23.2 ; sheet U_FPGA_Power/M0
NetR24_2: R24.2 ; sheet U_FPGA_Power/PROG_B

Not connected (* = marked no-connect by the designer): U1 A3(IO)* A4(IO_L05P_0/VREF_0)* A5(IO)* A6(IO)* A7(IO_L10P_0)* AA3(IO_L07P_6)* AA5(NC)* AA21(IO_L01P_3/VRN_3)* AA22(IO_L01N_3/VRP_3)* AB13(IO_L31P_5/D5)* AB22(IO_L01N_4/VRP_4)* AC22(IO_L01P_4/VRN_4)* AD1(IO_L01P_6/VRN_6)* AD2(IO_L01N_6/VRP_6)* AE7(IO_L10P_5/VRN_5)* AF7(IO_L10N_5/VRP_5)* B3(IO/VREF_0)* B5(IO_L06P_0)* B6(IO_L08P_0)* B7(IO_L10N_0)* B14(IO_L32N_1/GCLK5)* B18(IO_L18N_1)* C25(IO_L01N_2/VRP_2)* C26(IO_L01P_2/VRN_2)* D5(IO_L01P_0/VRN_0)* D14(IO_L31N_1/VREF_1)* D22(IO_L01N_1/VRP_1)* D25(IO_L03N_2/VREF_2)* D26(IO_L03P_2)* E5(IO_L01N_0/VRP_0)* E9(IO_L17N_0)* E16(IO_L25N_1)* E22(IO_L01P_1/VRN_1)* F5(IO_L01N_7/VRP_7)* F6(IO_L01P_7/VRN_7)* F7(IO/VREF_0)* F22(NC)* G6(IO_L05N_7)* G9(IO_L16N_0)* G10(IO/VREF_0)* G11(IO_L24N_0)* G12(IO_L27N_0)* G13(IO_L30N_0)* G14(IO_L30N_1)* G15(IO_L27N_1)* G16(IO_L24N_1)* G25(IO_L10N_2)* H6(IO_L10N_7)* H20(IO_L14N_2)* J6(IO_L16N_7)* K23(IO_L24N_2)* N20(IO_L35P_2)* N22(IO_L38P_2)* N23(IO_L39N_2)* N26(IO_L40P_2/VREF_2)* P20(IO_L35N_3)* R20(IO_L31N_3)* T20(IO_L27N_3)* T21(IO_L28P_3)* U20(IO_L20N_3)* U21(IO_L23P_3/VREF_3)* U22(IO_L23N_3)* V2(IO_L22P_6)* V20(IO_L20P_3)* V21(IO_L16N_3)* V22(IO_L21P_3)* W12(IO_L27P_5)* W20(IO_L10P_3)* W21(IO_L10N_3)* W22(IO_L16P_3)* Y4(IO_L08P_6)*

## Buses and harness runs
bus BUS_A[24..1]
bus BUS_D[31..0]
bus BUS_NBE[3..0]
bus DAU_TFT_BLUE[4..0]
bus DAU_TFT_CL[3..1]
bus DAU_TFT_GREEN[5..0]
bus DAU_TFT_RED[4..0]
bus DIP[7..0]
bus EXTEND_A[49..0]
bus EXTEND_B[49..0]
bus EXTEND_C[49..0]
bus FPGA_ID[3..0]
bus FPGA_M[2..0]
bus IO[35..0]
bus LED[7..0]
bus SRAM1_A[18..0]
bus SRAM1_D[15..0]
bus SRAM2_A[18..0]
bus SRAM2_D[15..0]
bus SW[4..0]
bus UGCLK[2..0]

## Layout directives
net class CLKS: BUS_SDRAM_CLK, BUS_SDRAM_FEEDBACK, FPGA_CLK, FPGA_CLK1, ONE_WIRE_DB_PB, REF_CLK, UGCLK0, UGCLK1, UGCLK2

## Notes on the sheet
- DAUGHTER BOARD I/O
- HOST PERIPHERALS
- JTAG
- PROGRAM
- Host Reset
- (near NT2) FPGA_ID = 0x0
- (near NT2) (Xilinx)
- Status LEDs
- SPI BUS
- DAUGHTER BOARD MEMORY RESOURCES
- CLOCKS
- TFT LCD DISPLAY INTERFACE
- ONE-WIRE CONNECTIONS
- Project Title
- Sheet Title
- Size:
- Date:
- File:
- A2
- Assy:
- Time:
- Revision:
- Sheet
- of
- (in symbol D-241-0001, part A) BANK 0
- (in symbol D-241-0001, part B) BANK 1
- (in symbol D-241-0001, part C) BANK 2
- (in symbol D-241-0001, part D) BANK 3
- (in symbol D-241-0001, part E) BANK 4
- (in symbol D-241-0001, part F) BANK 5
- (in symbol D-241-0001, part G) BANK 6
- (in symbol D-241-0001, part H) BANK 7

## Library data of the parts
NT2-NT6 NT8 = D-002-0002: Net-Tie, Surface Mount, 2 x 0.4mm x 0.2mm SMT Pads - For 0.2mm Track; Status: Production; Category: Net-Tie
R1-R4 = D-100-0088: Resistor, 4K7 1% 0402 (1005); Power Rating: 63 mW; Resistance: 4.7 K; Mounting Technology: Surface Mount; Status: Production; Tolerance: 1 %; Category: Resistor
R7-R10 R12 R14 R18 R20 R22-R24 = D-100-0131: Resistor, 100R 1% 0402 (1005); Power Rating: 63 mW; Mounting Technology: Surface Mount; Resistance: 100 R; Status: Production; Tolerance: 1 %; Category: Resistor
U1 = D-241-0001: FPGA, Xilinx Spartan3-1500 FG676 Speed=4; Supply Voltage: mV; Mounting Technology: Surface Mount; Status: Production; Technology: None; Category: IC-FPGA